# Altium schematic sheet SignalConditioning.SchDoc
size A4; SheetNumber: 4; SheetTotal: 5
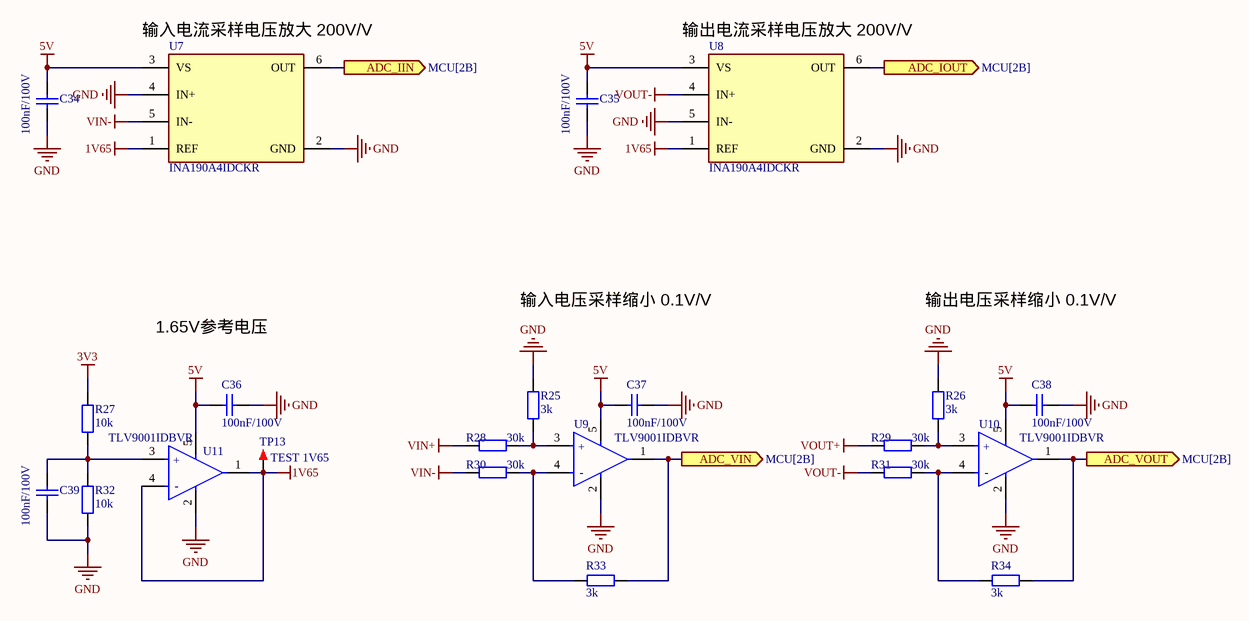
[diagram p0: SignalConditioning.SchDoc]

## Parts
C34  100nF/100V  [C0402_L]
C35  100nF/100V  [C0402_L]
C36  100nF/100V  [C0402_L]
C37  100nF/100V  [C0402_L]
C38  100nF/100V  [C0402_L]
C39  100nF/100V  [C0402_L]
R25  3k  [R 0402_L]
R26  3k  [R 0402_L]
R27  10k  [R 0402_L]
R28  30k  [R 0402_L]
R29  30k  [R 0402_L]
R30  30k  [R 0402_L]
R31  30k  [R 0402_L]
R32  10k  [R 0402_L]
R33  3k  [R 0402_L]
R34  3k  [R 0402_L]
TP13  TEST 1V65  [TEST TP1.4_W]
U7  INA190A4IDCKR  [FP-DCK0006A-IPC_C]
U8  INA190A4IDCKR  [FP-DCK0006A-IPC_C]
U9  TLV9001IDBVR  [FP-DBV0005A-IPC_B]
U10  TLV9001IDBVR  [FP-DBV0005A-IPC_B]
U11  TLV9001IDBVR  [FP-DBV0005A-IPC_B]

## Ports
ADC_IIN (out, see MCU[2B]), ADC_IOUT (out, see MCU[2B]), ADC_VIN (out, see MCU[2B]), ADC_VOUT (out, see MCU[2B])

## Nets
1V65: TP13.1 U7.1(REF) U8.1(REF) U11.1(OUT) U11.4(IN-)
3V3: R27.2
5V: C34.2 C35.2 C36.2 C37.2 C38.2 U7.3(VS) U8.3(VS) U9.5(V+) U10.5(V+) U11.5(V+)
GND: C34.1 C35.1 C36.1 C37.1 C38.1 C39.1 R25.2 R26.2 R32.1 U7.2(GND) U7.4(IN+) U8.2(GND) U8.5(IN-) U9.2(V-) U10.2(V-) U11.2(V-)
VIN+: R28.2
VIN-: R30.2 U7.5(IN-)
VOUT+: R29.2
VOUT-: R31.2 U8.4(IN+)
ADC_IIN: U7.6(OUT) ; port ADC_IIN
ADC_IOUT: U8.6(OUT) ; port ADC_IOUT
ADC_VIN: R33.1 U9.1(OUT) ; port ADC_VIN
ADC_VOUT: R34.1 U10.1(OUT) ; port ADC_VOUT
NetC39_2: C39.2 R27.1 R32.2 U11.3(IN+)
NetR25_1: R25.1 R28.1 U9.3(IN+)
NetR26_1: R26.1 R29.1 U10.3(IN+)
NetR30_1: R30.1 R33.2 U9.4(IN-)
NetR31_1: R31.1 R34.2 U10.4(IN-)

## Notes on the sheet
- (near U7) 输入电流采样电压放大 200V/V
- (near U8) 输出电流采样电压放大 200V/V
- 1.65V参考电压
- 输入电压采样缩小 0.1V/V
- 输出电压采样缩小 0.1V/V
- (in symbol CMP-04895-000230-1) +; -

## Library data of the parts
C34-C39 = C: 贴片电容; BOM名称: 无极性贴片电容; 联系卖家，免费查找封装: 唯一出售店铺网址https://shop463601444.taobao.com
R25-R34 = R: 贴片电阻; 版权归属: 源创客; BOM名称: 贴片电阻; 学习资源: www.ooocke.com
TP13 = TEST TP: 测试环; 联系卖家，免费查找封装: 唯一出售店铺网址https://shop463601444.taobao.com; 封装库来自淘宝卖家ID：黄晶宝石: 其他店铺购入均为盗版假冒封装库，请立即申请退款; BOM名称: 测试环
U7 U8 = CMP-04895-000472-1: IC CURR SENSE 1 CIRCUIT SC70-6
U9-U11 = CMP-04895-000230-1: IC CMOS 1 CIRCUIT SOT23-5; Output Current per Channel: 40mA; Input Bias Current: 5pA; Number of Circuits: 1; Operating Supply Current: 60uA; Input Offset Voltage (Vos): 400uV; Gain Bandwidth Product: 1MHz; Slew Rate: 2V/µs; Packaging: Tape and Reel; RoHS Compliant: Yes; Mount: Surface Mount; Max Operating Temperature: 125°C; Min Operating Temperature: -40°C; Case/Package: SOT-23-6